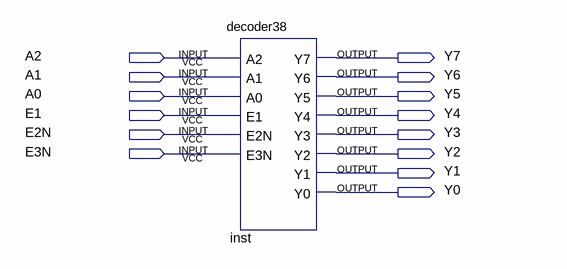
[diagram p0: schematic sheet]
// Quartus schematic exp_2.bdf as structural Verilog: 1 symbols, 14 pins
module exp_2 (
  input  A2,
  input  A1,
  input  A0,
  input  E1,
  input  E2N,
  input  E3N,
  output Y7,
  output Y6,
  output Y5,
  output Y4,
  output Y3,
  output Y2,
  output Y1,
  output Y0
);

  decoder38 inst (
    .A2(A2), .A1(A1), .A0(A0), .E1(E1), .E2N(E2N), .E3N(E3N), .Y7(Y7), .Y6(Y6), .Y5(Y5), .Y4(Y4), .Y3(Y3),
    .Y2(Y2), .Y1(Y1), .Y0(Y0));
endmodule
